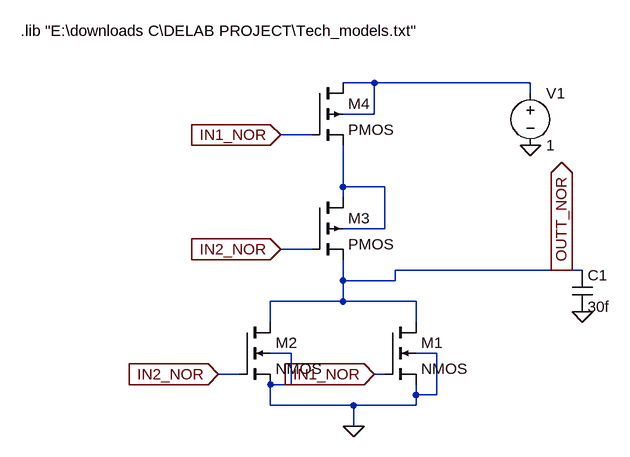
[diagram p0: schematic gate_nor.asc]
gate_nor.asc, the LTspice schematic file:
Version 4
SHEET 1 880 680
WIRE 224 -176 176 -176
WIRE 464 -176 224 -176
WIRE 464 -160 464 -176
WIRE 224 -128 224 -176
WIRE 224 -128 176 -128
WIRE 128 -96 80 -96
WIRE 176 -16 176 -80
WIRE 240 -16 176 -16
WIRE 176 0 176 -16
WIRE 240 48 240 -16
WIRE 240 48 176 48
WIRE 128 80 80 80
WIRE 512 112 256 112
WIRE 544 112 512 112
WIRE 176 128 176 96
WIRE 256 128 256 112
WIRE 256 128 176 128
WIRE 176 160 176 128
WIRE 176 160 64 160
WIRE 288 160 176 160
WIRE 64 192 64 160
WIRE 288 192 288 160
WIRE 96 240 64 240
WIRE 320 240 288 240
WIRE 16 272 -16 272
WIRE 240 272 224 272
WIRE 96 288 96 240
WIRE 96 288 64 288
WIRE 288 304 288 288
WIRE 320 304 320 240
WIRE 320 304 288 304
WIRE 64 320 64 288
WIRE 192 320 64 320
WIRE 288 320 288 304
WIRE 288 320 192 320
WIRE 192 352 192 320
FLAG 192 352 0
FLAG 464 -80 0
FLAG 544 176 0
FLAG 80 -96 IN1_NOR
IOPIN 80 -96 In
FLAG 224 272 IN1_NOR
IOPIN 224 272 In
FLAG 80 80 IN2_NOR
IOPIN 80 80 In
FLAG -16 272 IN2_NOR
IOPIN -16 272 In
FLAG 512 112 OUTT_NOR
IOPIN 512 112 Out
SYMBOL nmos4 240 192 R0
SYMATTR InstName M1
SYMATTR Value2 l=32n w=64n
SYMBOL nmos4 16 192 R0
SYMATTR InstName M2
SYMATTR Value2 l=32n w=64n
SYMBOL pmos4 128 0 R0
SYMATTR InstName M3
SYMATTR Value2 l=32n w=128n
SYMBOL pmos4 128 -176 R0
SYMATTR InstName M4
SYMATTR Value2 l=32n w=128n
SYMBOL voltage 464 -176 R0
WINDOW 123 0 0 Left 0
WINDOW 39 0 0 Left 0
SYMATTR InstName V1
SYMATTR Value 1
SYMBOL cap 528 112 R0
SYMATTR InstName C1
SYMATTR Value 30f
TEXT -320 -256 Left 2 !.lib "E:\\downloads C\\DELAB PROJECT\\Tech_models.txt"

The netlist it stands for:
* gate_nor.asc
M1 OUTT_NOR IN1_NOR 0 0 NMOS l=32n w=64n
M2 OUTT_NOR IN2_NOR 0 0 NMOS l=32n w=64n
M3 N002 IN2_NOR OUTT_NOR N002 PMOS l=32n w=128n
M4 N001 IN1_NOR N002 N001 PMOS l=32n w=128n
V1 N001 0 1
C1 OUTT_NOR 0 30f
.model NMOS NMOS
.model PMOS PMOS
.lib standard.mos
.lib "E:\downloads C\DELAB PROJECT\Tech_models.txt"
.backanno
.end